# Altium schematic sheet LEDBAKL_MP3202_AP3032.SchDoc
size A3; SheetNumber: 12; SheetTotal: 27
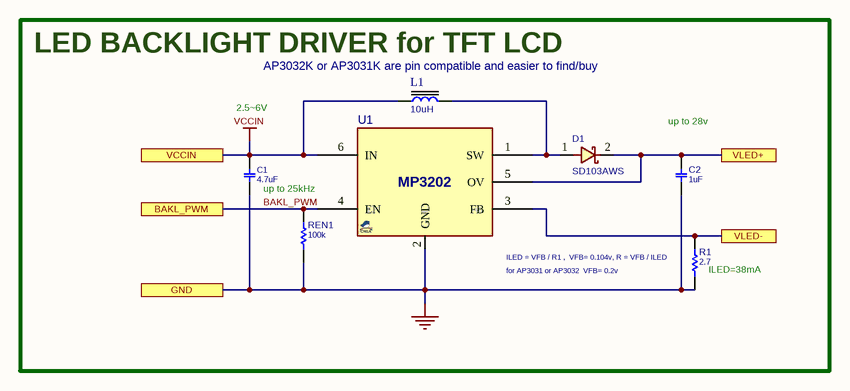
[diagram p0: LEDBAKL_MP3202_AP3032.SchDoc]

## Parts
C1  4.7uF  [C0402]
C2  1uF  [C0603]
D1  SD103AWS  [D_SOD323]
L1  10uH  [L_4]
R1  2.7  [R0402]
REN1  100k  [R0402]
U1  MP3202  [SOT23_6]  (value not drawn)

## Ports
BAKL_PWM, GND, VCCIN, VLED+, VLED-

## Nets
GND: C1.1 C2.1 R1.2 REN1.2 U1.2(GND) ; port GND
VCCIN: C1.2 L1.1 U1.6(IN) ; port VCCIN
BAKL_PWM: REN1.1 U1.4(EN) ; port BAKL_PWM
VLED+: C2.2 D1.2 U1.5(OV) ; port VLED+
VLED-: R1.1 U1.3(FB) ; port VLED-
NetD1_1: D1.1 L1.2 U1.1(SW)

## Notes on the sheet
- (near L1) LED BACKLIGHT DRIVER for TFT LCD
- 2.5~6V
- (near L1) AP3032K or AP3031K are pin compatible and easier to find/buy
- (near C2) up to 28v
- (near C1) up to 25kHz
- ILED = VFB / R1 ,  VFB= 0.104v, R = VFB / ILED
- (near U1) for AP3031 or AP3032  VFB= 0.2v
- (near R1) ILED=38mA

## Library data of the parts
C1 = CAP_SMD_MLCC: CAP, MLCC; PARAM: X5R, 10%; MANF_P#: CL05A475MP5NRNC; MANF: Samsung; PARAM2: 10v; PRICE: 10,000:	$0.013; ASSEMBLY: ASSEMBLY; VALUE: 4.7uF
C2 = CAP_SMD_MLCC: CAP, MLCC; PARAM: X5R, 10%; MANF_P#: CL10A105KB8NNNC; MANF: Samsung; PARAM2: 50v; PRICE: 50,000:	$0.006; ASSEMBLY: ASSEMBLY; VALUE: 1uF
D1 = DIODE_SMD_SCHOTTKY_1N5819: DIODE, SCHOTTKY, 40V, 2A; MANF: DIODES; DESC: DESCRIPTION; MANF_P#: SD103AWS; ASSEMBLY: ASSEMBLY; PRICE: PRICE; PARAM2: 2A; PARAM: 40V; VALUE: SD103AWS
L1 = INDPWR_SMD: INDUCTOR, POWER, SMD; MANF_P#: GCD43-100MC; VALUE: 10uH
R1 REN1 = RES_SMD: RESISTOR, SMD, 20K, 0402; MANF: Yageo; PARAM: 0.063W; DIST#: MOUSER; PARAM2: 1%; MANF_P#: RK73H1ETTP2002F; ASSEMBLY: ASSEMBLY; PRICE: 100= 0.5$; DESC: RESISTOR, SMD, 20K, 0402
  R1: VALUE: 2.7
  REN1: VALUE: 100k
U1 = VREG_MP3202_SOT23: REG, Switching, Boost, 1.3A, ADJ, 1MHz, SOT-23-6; PARAM: 1.3A, 1MHz; PARAM2: 2.5~6Vin; MANF_P#: MP3202DJ; MANF: MPS; VALUE: MP3202